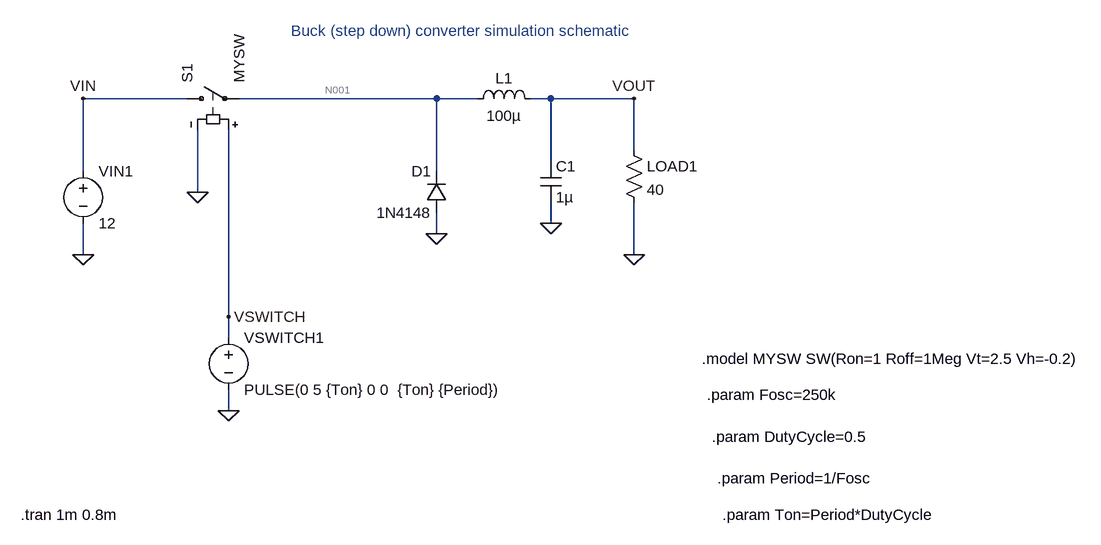
[diagram p0: schematic Draft8.asc]
Draft8.asc, the LTspice schematic file:
Version 4
SHEET 1 1152 680
WIRE -272 -192 -432 -192
WIRE 112 -192 -192 -192
WIRE 176 -192 112 -192
WIRE 288 -192 256 -192
WIRE 416 -192 288 -192
WIRE 416 -112 416 -192
WIRE 288 -96 288 -192
WIRE -432 -80 -432 -192
WIRE 112 -80 112 -192
WIRE -256 -48 -256 -144
WIRE 288 0 288 -32
WIRE 112 16 112 -16
WIRE -432 48 -432 0
WIRE 416 48 416 -32
WIRE -208 144 -208 -144
WIRE -208 176 -208 144
WIRE -208 288 -208 256
FLAG -432 48 0
FLAG -256 -48 0
FLAG -208 288 0
FLAG 112 16 0
FLAG 288 0 0
FLAG 416 48 0
FLAG -432 -192 VIN
FLAG -208 144 VSWITCH
FLAG 416 -192 VOUT
SYMBOL voltage -432 -96 R0
WINDOW 123 0 0 Left 0
WINDOW 39 0 0 Left 0
SYMATTR InstName VIN1
SYMATTR Value 12
SYMBOL sw -288 -192 R270
SYMATTR InstName S1
SYMATTR Value MYSW
SYMBOL voltage -208 160 R0
WINDOW 123 0 0 Left 0
WINDOW 39 0 0 Left 0
SYMATTR InstName VSWITCH1
SYMATTR Value PULSE(0 5 {Ton} 0 0  {Ton} {Period})
SYMBOL ind 160 -176 R270
WINDOW 0 32 56 VTop 2
WINDOW 3 5 56 VBottom 2
SYMATTR InstName L1
SYMATTR Value 100µ
SYMBOL diode 128 -16 R180
WINDOW 0 24 64 Left 2
WINDOW 3 24 0 Left 2
SYMATTR InstName D1
SYMATTR Value 1N4148
SYMBOL cap 272 -96 R0
SYMATTR InstName C1
SYMATTR Value 1µ
SYMBOL res 400 -128 R0
SYMATTR InstName LOAD1
SYMATTR Value 40
TEXT -112 -296 Left 2 ;Buck (step down) converter simulation schematic
TEXT 520 208 Left 2 !.model MYSW SW(Ron=1 Roff=1Meg Vt=2.5 Vh=-0.2)
TEXT 528 264 Left 2 !.param Fosc=250k
TEXT 536 328 Left 2 !.param DutyCycle=0.5
TEXT 544 392 Left 2 !.param Period=1/Fosc
TEXT 552 448 Left 2 !.param Ton=Period*DutyCycle
TEXT -528 448 Left 2 !.tran 1m 0.8m

The netlist it stands for:
* Draft8.asc
VIN1 VIN 0 12
S1 VIN N001 VSWITCH 0 MYSW
VSWITCH1 VSWITCH 0 PULSE(0 5 {Ton} 0 0  {Ton} {Period})
L1 N001 VOUT 100µ
D1 0 N001 1N4148
C1 VOUT 0 1µ
R§LOAD1 VOUT 0 40
.model D D
.lib standard.dio
* Buck (step down) converter simulation schematic
.model MYSW SW(Ron=1 Roff=1Meg Vt=2.5 Vh=-0.2)
.param Fosc=250k
.param DutyCycle=0.5
.param Period=1/Fosc
.param Ton=Period*DutyCycle
.tran 1m 0.8m
.backanno
.end

* Results of the author's LTspice run, read from the files saved beside the schematic
* Operating Point, zero values left out:
*   V(vin) = 12 V
*   V(n001) = 480 µV
*   V(vout) = 480 µV
*   I(D1) = -26.55 pA
*   I(L1) = 12 µA
*   I(Load1) = 12 µA
*   I(S1) = -12 µA
*   I(Vin1) = -12 µA
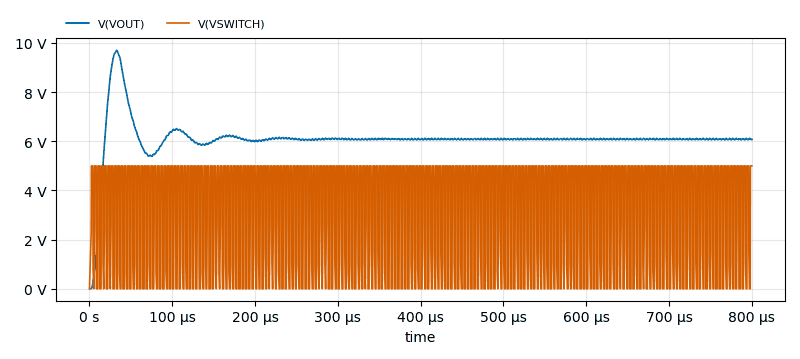
[diagram p1: Transient Analysis of Draft8.asc, plotted from the saved traces]
* Transient Analysis, 1 run:
*   V(VOUT): min 480 µV, max 9.702 V, average 6.089 V, rms 6.148 V, last 6.078 V
*   V(VSWITCH): min 0 V, max 5 V, average 2.748 V, rms 3.654 V, last 5 V